# EAGLE design schematic (EAGLE 6.2)
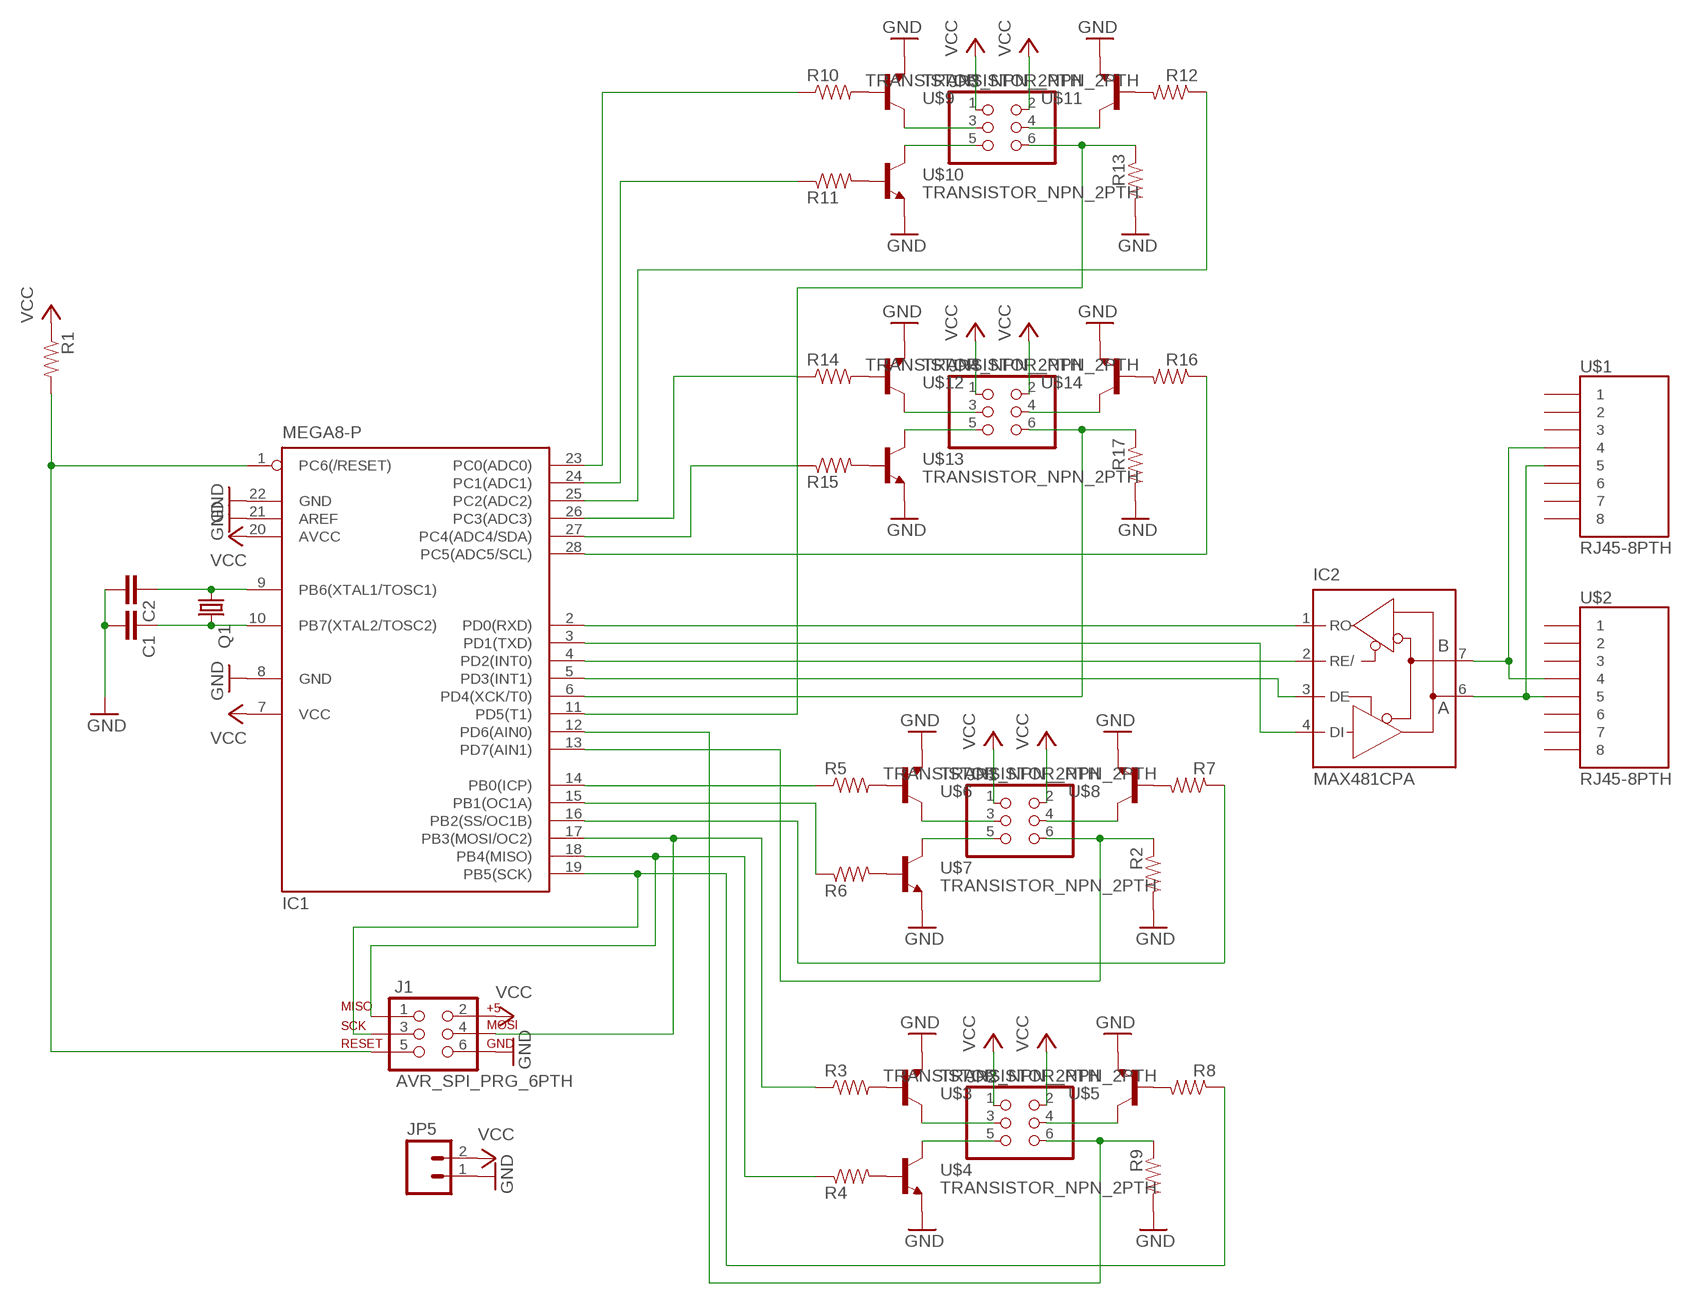
[diagram p0: schematic, sheet 1]

## Parts
C1  CAPKIT  [CAP-PTH-SMALL-KIT]
C2  CAPKIT  [CAP-PTH-SMALL-KIT]
IC1  MEGA8-P  [DIL28-3]
IC2  MAX481CPA  [DIL08]
J1  AVR_SPI_PRG_6PTH  [2X3]
JP1  PINHD-2X3  [2X03]
JP2  PINHD-2X3  [2X03]
JP3  PINHD-2X3  [2X03]
JP4  PINHD-2X3  [2X03]
JP5  M023.5MM  [SCREWTERMINAL-3.5MM-2]
Q1  CRYSTALHC49U-V  [HC49U-V]
R1  RESISTORPTH-1/4W  [AXIAL-0.4]
R2  RESISTORPTH-1/4W  [AXIAL-0.4]
R3  RESISTORPTH-1/4W  [AXIAL-0.4]
R4  RESISTORPTH-1/4W  [AXIAL-0.4]
R5  RESISTORPTH-1/4W  [AXIAL-0.4]
R6  RESISTORPTH-1/4W  [AXIAL-0.4]
R7  RESISTORPTH-1/4W  [AXIAL-0.4]
R8  RESISTORPTH-1/4W  [AXIAL-0.4]
R9  RESISTORPTH-1/4W  [AXIAL-0.4]
R10  RESISTORPTH-1/4W  [AXIAL-0.4]
R11  RESISTORPTH-1/4W  [AXIAL-0.4]
R12  RESISTORPTH-1/4W  [AXIAL-0.4]
R13  RESISTORPTH-1/4W  [AXIAL-0.4]
R14  RESISTORPTH-1/4W  [AXIAL-0.4]
R15  RESISTORPTH-1/4W  [AXIAL-0.4]
R16  RESISTORPTH-1/4W  [AXIAL-0.4]
R17  RESISTORPTH-1/4W  [AXIAL-0.4]
U$1  RJ45-8PTH  [RJ45-8]
U$2  RJ45-8PTH  [RJ45-8]
U$3  TRANSISTOR_NPN_2PTH  [TO-92]
U$4  TRANSISTOR_NPN_2PTH  [TO-92]
U$5  TRANSISTOR_NPN_2PTH  [TO-92]
U$6  TRANSISTOR_NPN_2PTH  [TO-92]
U$7  TRANSISTOR_NPN_2PTH  [TO-92]
U$8  TRANSISTOR_NPN_2PTH  [TO-92]
U$9  TRANSISTOR_NPN_2PTH  [TO-92]
U$10  TRANSISTOR_NPN_2PTH  [TO-92]
U$11  TRANSISTOR_NPN_2PTH  [TO-92]
U$12  TRANSISTOR_NPN_2PTH  [TO-92]
U$13  TRANSISTOR_NPN_2PTH  [TO-92]
U$14  TRANSISTOR_NPN_2PTH  [TO-92]

## Nets
GND: C1.2 C2.2 IC1.8(GND) IC1.21(AREF) IC1.22(GND) J1.6 JP5.1 R2.P$2 R9.P$2 R13.P$2 R17.P$2 U$3.3(E) U$4.3(E) U$5.3(E) U$6.3(E) U$7.3(E) U$8.3(E) U$9.3(E) U$10.3(E) U$11.3(E) U$12.3(E) U$13.3(E) U$14.3(E)
N$1: IC2.7(B) U$1.4 U$2.4
N$2: IC2.6(A) U$1.5 U$2.5
N$3: IC1.26(PC3(ADC3)) R14.P$1
N$4: C2.1 IC1.9(PB6(XTAL1/TOSC1)) Q1.1
N$5: C1.1 IC1.10(PB7(XTAL2/TOSC2)) Q1.2
N$6: JP1.3 U$6.1(C)
N$7: IC1.2(PD0(RXD)) IC2.1(RO)
N$8: IC1.3(PD1(TXD)) IC2.4(DI)
N$9: JP1.5 U$7.1(C)
N$10: JP1.4 U$8.1(C)
N$11: IC1.27(PC4(ADC4/SDA)) R15.P$1
N$12: IC1.14(PB0(ICP)) R5.P$1
N$13: IC1.15(PB1(OC1A)) R6.P$1
N$14: IC1.13(PD7(AIN1)) JP1.6 R2.P$1
N$16: IC1.5(PD3(INT1)) IC2.3(DE)
N$17: R5.P$2 U$6.2(B)
N$18: IC1.1(PC6(/RESET)) J1.5 R1.P$2
N$19: R6.P$2 U$7.2(B)
N$20: R7.P$2 U$8.2(B)
N$21: IC1.12(PD6(AIN0)) JP2.6 R9.P$1
N$22: IC1.4(PD2(INT0)) IC2.2(RE/)
N$23: R3.P$2 U$3.2(B)
N$24: R4.P$2 U$4.2(B)
N$25: R8.P$2 U$5.2(B)
N$26: IC1.19(PB5(SCK)) J1.3 R8.P$1
N$27: IC1.16(PB2(SS/OC1B)) R7.P$1
N$28: JP2.3 U$3.1(C)
N$29: JP2.5 U$4.1(C)
N$30: JP2.4 U$5.1(C)
N$31: IC1.11(PD5(T1)) JP3.6 R13.P$1
N$32: R10.P$2 U$9.2(B)
N$33: R11.P$2 U$10.2(B)
N$34: R12.P$2 U$11.2(B)
N$35: IC1.24(PC1(ADC1)) R11.P$1
N$36: IC1.25(PC2(ADC2)) R12.P$1
N$39: JP3.3 U$9.1(C)
N$40: JP3.5 U$10.1(C)
N$41: JP3.4 U$11.1(C)
N$42: IC1.6(PD4(XCK/T0)) JP4.6 R17.P$1
N$43: R14.P$2 U$12.2(B)
N$45: R15.P$2 U$13.2(B)
N$47: R16.P$2 U$14.2(B)
N$48: IC1.23(PC0(ADC0)) R10.P$1
N$50: IC1.28(PC5(ADC5/SCL)) R16.P$1
N$51: JP4.3 U$12.1(C)
N$52: JP4.5 U$13.1(C)
N$53: JP4.4 U$14.1(C)
N$54: IC1.17(PB3(MOSI/OC2)) J1.4 R3.P$1
N$55: IC1.18(PB4(MISO)) J1.1 R4.P$1
VCC: IC1.7(VCC) IC1.20(AVCC) J1.2 JP1.1 JP1.2 JP2.1 JP2.2 JP3.1 JP3.2 JP4.1 JP4.2 JP5.2 R1.P$1
Unconnected: U$1.1 U$1.2 U$1.3 U$1.6 U$1.7 U$1.8 U$2.1 U$2.2 U$2.3 U$2.6 U$2.7 U$2.8

## Power pins joined to a net without a drawn wire
GND: IC2.5(GND)
VCC: IC2.8(VCC)

## Library data of the parts
C1 C2 = SparkFun-Passives:CAP: Capacitor Standard 0603 ceramic capacitor, and 0.1" leaded capacitor.
IC1 = atmel:MEGA8-P: MICROCONTROLLER 8 Kbytes FLASH, 1 kbytes SRAM, 512 bytes EEPROM, USART, 4-channel 10 bit ADC, 2-channel 8 bit ADC Pin compatible with Atmega48, ATMega88, ATMega168 Source: avr.lbr; OC_FARNELL: unknown; OC_NEWARK: unknown
IC2 = maxim:MAX481CPA: RS485 TRANSEIVER; MPN: MAX481CPA+; OC_FARNELL: unknown; OC_NEWARK: 99K3445
J1 = SparkFun-Connectors:AVR_SPI_PRG_6: AVR ISP 6 Pin This is the reduced ISP connector for AVR programming. Common on Arduino. This footprint will take up less PCB space and can be used with a 10-pin to 6-pin adapter such as SKU: BOB-08508
JP1-JP4 = SparkFun-Connectors:PINHD-2X3: PIN HEADER
JP5 = SparkFun-Connectors:M02: Header 2 Standard 2-pin 0.1" header. Use with straight break away headers (SKU : PRT-00116), right angle break away headers (PRT-00553), swiss pins (PRT-00743), machine pins (PRT-00117), and female headers (PRT-00115). Molex polarized connector foot print use with SKU : PRT-08233 with associated crimp pins and housings.
Q1 = crystal:CRYSTAL: CRYSTAL; OC_FARNELL: 1666969; OC_NEWARK: unknown
R1-R17 = SparkFun-Passives:RESISTOR: Resistor Basic schematic elements and footprints for 0603, 1206, and PTH resistors.
U$1 U$2 = SparkFun-Connectors:RJ45-8: RJ45 Jack Simple RJ45, 8-pin connection - connector for common Cat5, Cat5e, and Cat6 Ethernet cables. Footprint not yet proven in production. Connector sku is PRT-00643; Breakout PCB sku is BOB-00716.
U$3-U$14 = SparkFun-DiscreteSemi:TRANSISTOR_NPN_2: Alternate TO-92 NPN BJT

## Board
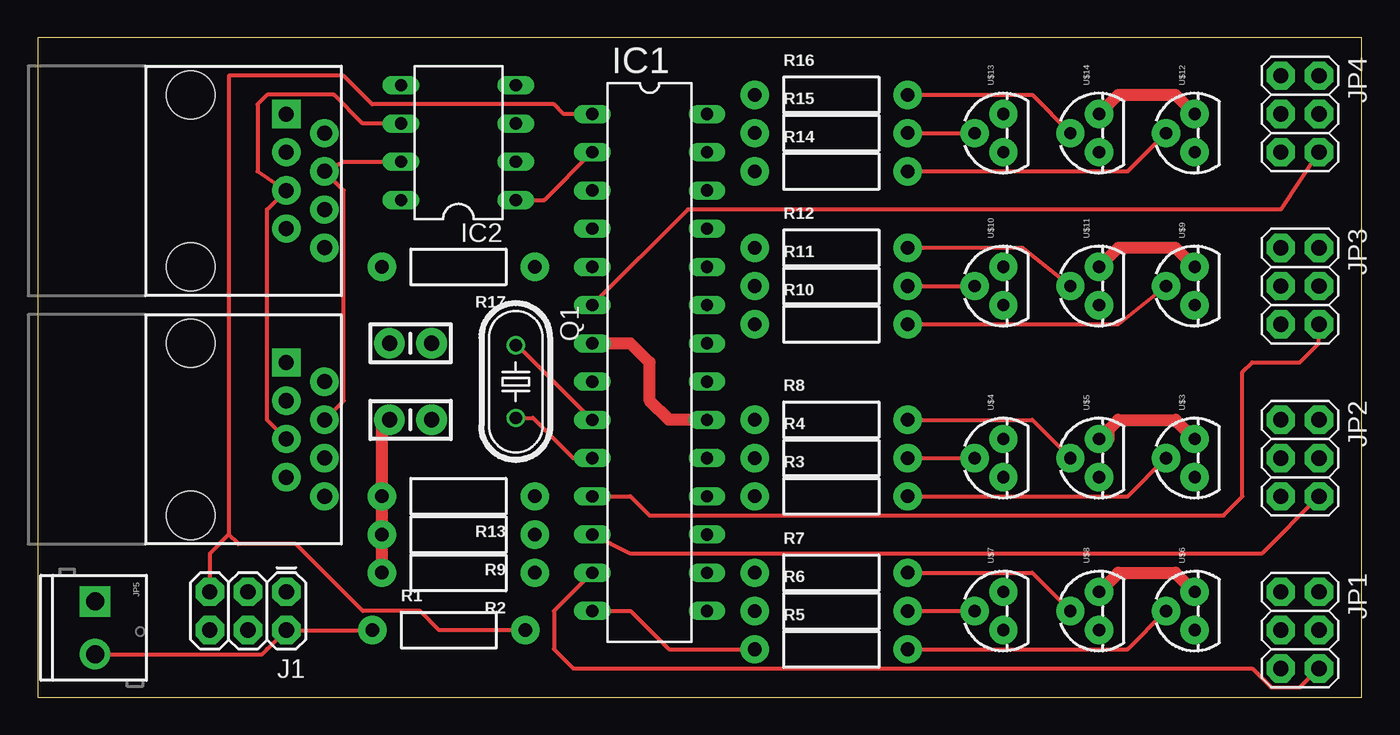
[diagram p1: board, top side]
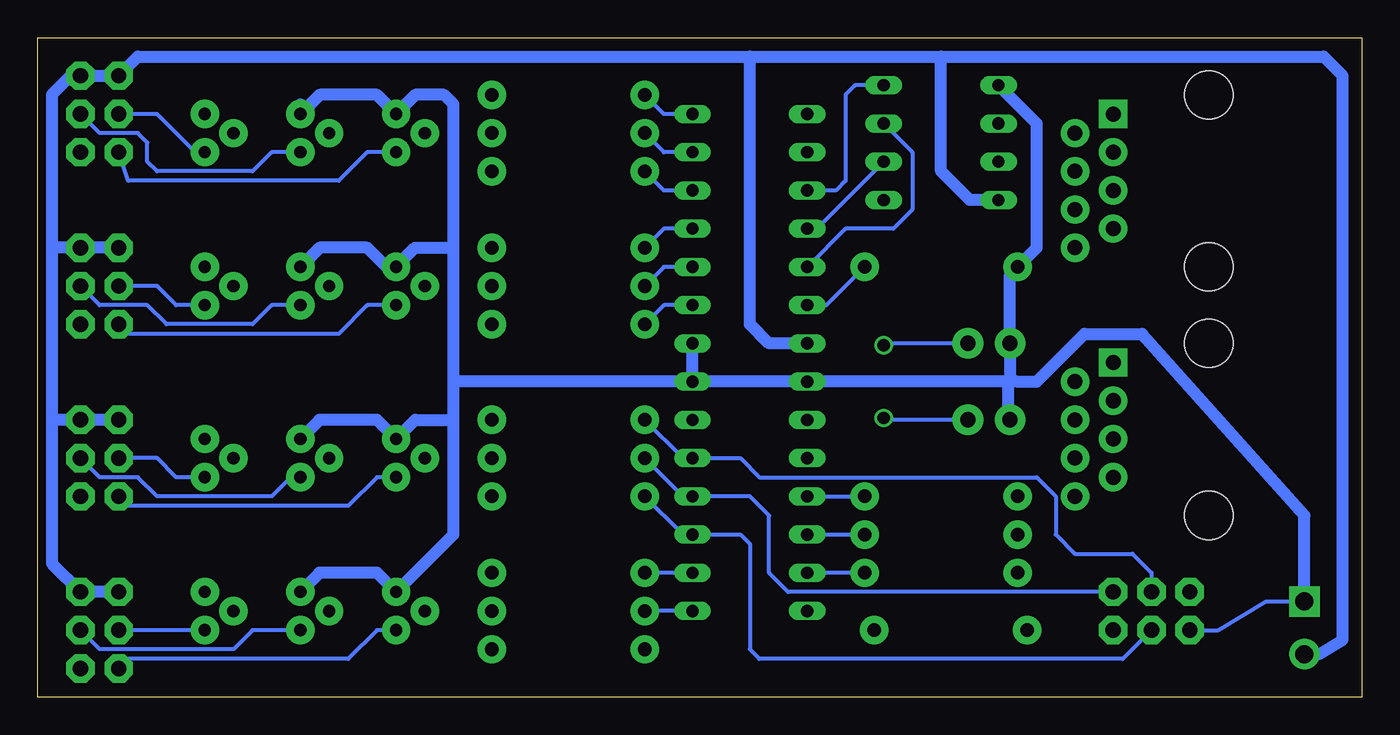
[diagram p2: board, bottom side, seen from below]

Size 87.94 x 43.8 mm. Coordinates in mm from the lower left corner, seen from the top.
Outline: 0,0 87.94,0 87.94,43.8 0,43.8 0,0
Copper layers (1*16): Top 0.0356mm / dielectric 1.5011mm / Bottom 0.0356mm
Design rules: minimum track width 6mil, minimum drill 13mil, track to track 6mil, track to pad 6mil, pad to pad 6mil, via to via 6mil, smd to smd 6mil, copper to edge 15mil, drill to drill 6mil, minimum pad ring 7mil, minimum via ring 7mil, stop-mask expansion 4mil, vias tented up to drill 0mil, thermal gap 10mil

### Footprints (pad centres in the part's own frame; a part is rotated, then mirrored left to right if it is on the bottom)
CAP-PTH-SMALL-KIT = drill 1.016 pad 2.032: 1 -1.397,0; 2 1.397,0
DIL28-3 = drill 0.813 long: 1 -16.51,-3.81; 2 -13.97,-3.81; 3 -11.43,-3.81; 4 -8.89,-3.81; 5 -6.35,-3.81; 6 -3.81,-3.81; 7 -1.27,-3.81; 8 1.27,-3.81; 9 3.81,-3.81; 10 6.35,-3.81; 11 8.89,-3.81; 12 11.43,-3.81; 13 13.97,-3.81; 14 16.51,-3.81; 15 16.51,3.81; 16 13.97,3.81; 17 11.43,3.81; 18 8.89,3.81; 19 6.35,3.81; 20 3.81,3.81; 21 1.27,3.81; 22 -1.27,3.81; 23 -3.81,3.81; 24 -6.35,3.81; 25 -8.89,3.81; 26 -11.43,3.81; 27 -13.97,3.81; 28 -16.51,3.81
DIL08 = drill 0.813 long: 1 -3.81,-3.81; 2 -1.27,-3.81; 3 1.27,-3.81; 4 3.81,-3.81; 5 3.81,3.81; 6 1.27,3.81; 7 -1.27,3.81; 8 -3.81,3.81
2X3 = drill 1.016 pad 1.88 octagon: 1 0,0; 2 0,2.54; 3 2.54,0; 4 2.54,2.54; 5 5.08,0; 6 5.08,2.54
2X03 = drill 1.016 pad 1.88 octagon: 1 -2.54,-1.27; 2 -2.54,1.27; 3 0,-1.27; 4 0,1.27; 5 2.54,-1.27; 6 2.54,1.27
SCREWTERMINAL-3.5MM-2 = drill 1.2 pad 2.032 square: 1 0,0 | drill 1.2 pad 2.032: 2 3.5,0
HC49U-V = drill 0.813: 1 -2.413,0; 2 2.413,0
AXIAL-0.4 = drill 0.9 pad 1.88: P$1 -5.08,0; P$2 5.08,0
RJ45-8 = drill 1 pad 1.88 square: 1 -4.445,6.35 | drill 1 pad 1.88: 2 -3.175,8.89; 3 -1.905,6.35; 4 -0.635,8.89; 5 0.635,6.35; 6 1.905,8.89; 7 3.175,6.35; 8 4.445,8.89 | hole 3.2: -5.715,0; 5.715,0
TO-92 = drill 0.813 pad 1.88: 1 -1.27,0; 2 0,1.905; 3 1.27,0

### Placement (x,y rotation side)
C1  24.77,18.41 180 top
C2  24.77,23.49 180 top
IC1  40.64,22.23 270 top
IC2  27.94,36.83 90 top
J1  16.51,6.98 180 top
JP1  83.82,4.45 270 top
JP2  83.82,15.88 270 top
JP3  83.82,27.3 270 top
JP4  83.82,38.73 270 top
JP5  3.81,6.35 270 top
Q1  31.75,20.95 270 top
R1  27.3,4.45 0 top
R2  27.94,8.26 180 top
R3  52.7,13.34 0 top
R4  52.7,15.88 0 top
R5  52.7,3.18 0 top
R6  52.7,5.71 0 top
R7  52.7,8.26 0 top
R8  52.7,18.41 0 top
R9  27.94,10.8 180 top
R10  52.7,24.77 0 top
R11  52.7,27.3 0 top
R12  52.7,29.84 0 top
R13  27.94,13.34 180 top
R14  52.7,34.92 0 top
R15  52.7,37.46 0 top
R16  52.7,40 0 top
R17  27.94,28.58 180 top
U$1  10.16,34.29 270 top
U$2  10.16,17.78 270 top
U$3  76.83,15.88 90 top
U$4  64.13,15.88 90 top
U$5  70.48,15.88 90 top
U$6  76.83,5.71 90 top
U$7  64.13,5.71 90 top
U$8  70.48,5.71 90 top
U$9  76.83,27.3 90 top
U$10  64.13,27.3 90 top
U$11  70.48,27.3 90 top
U$12  76.83,37.46 90 top
U$13  64.13,37.46 90 top
U$14  70.48,37.46 90 top

### Tracks (layer width: path | path; a pad name or v marks a point on that pad's centre or on a via)
GND
  Top 0.813: U$11.3 71.75,29.84 75.56,29.84 U$9.3 | U$14.3 71.75,40 75.56,40 U$12.3 | U$5.3 71.12,17.14 71.12,17.78 71.75,18.41 75.56,18.41 U$3.3 | U$8.3 71.75,8.26 75.56,8.26 U$6.3 | R2.P$2 R9.P$2 R13.P$2 22.86,17.91 C1.2
  Bottom 0.254: 23.37,21.46 22.86,20.95 | 23.5,18.54 C1.2 | 23.37,28.07 R17.P$2 | J1.6 9.53,4.45 6.35,6.35 JP5.1
  Bottom 0.813: IC1.21 IC1.8 23.5,20.95 | U$11.3 69.22,29.84 66.04,29.84 64.77,28.58 U$10.3 62.86,29.84 60.33,29.84 | 70.48,39.37 U$14.3 69.22,40 65.41,40 U$13.3 62.86,40 60.96,40 60.33,39.37 60.33,29.84 | U$5.3 69.22,18.41 65.41,18.41 U$4.3 62.86,18.41 60.33,18.41 | IC1.21 60.33,20.95 | 60.33,20.95 60.33,29.84 | 60.33,18.41 60.33,10.8 U$7.3 65.41,8.26 69.22,8.26 U$8.3 | 60.33,18.41 60.33,20.95 | 23.5,20.95 22.86,20.95 21.59,20.95 18.42,24.13 14.6,24.13 3.81,12.06 JP5.1 | IC1.21 IC1.22 | 23.37,21.46 C2.2 23.37,28.07 | 23.5,20.95 23.5,18.54 | R17.P$2 21.59,29.84 21.59,38.1 IC2.5
N$1
  Top 0.254: U$2.4 20.32,19.69 20.32,33.66 U$1.4 20.32,35.56 IC2.7
N$2
  Top 0.254: U$2.5 15.24,18.41 15.24,32.38 U$1.5 14.6,34.92 14.6,39.37 15.24,40 19.69,40 21.59,38.1 IC2.6
N$3
  Bottom 0.254: IC1.26 46.35,33.66 R14.P$1
N$4
  Top 0.254: Q1.1 31.88,23.37 IC1.9
  Bottom 0.254: C2.1 31.62,23.49 Q1.1
N$5
  Top 0.254: Q1.2 32.89,18.54 35.56,15.88 IC1.10
  Bottom 0.254: C1.1 31.62,18.41 Q1.2
N$6
  Bottom 0.254: U$6.1 JP1.3
N$7
  Top 0.254: IC2.1 33.66,33.02 IC1.2
N$8
  Bottom 0.254: IC2.4 33.66,40.64 34.29,40 34.29,34.29 34.92,33.66 IC1.3
N$9
  Bottom 0.254: U$7.1 65.41,4.45 67.31,2.54 81.91,2.54 JP1.5
N$10
  Bottom 0.254: U$8.1 73.66,4.45 74.93,3.18 83.82,3.18 JP1.4
N$11
  Bottom 0.254: IC1.27 46.35,36.2 R15.P$1
N$12
  Top 0.254: IC1.14 39.37,5.71 41.91,3.18 R5.P$1
N$13
  Bottom 0.254: IC1.15 R6.P$1
N$14
  Top 0.254: IC1.13 34.29,5.71 34.29,3.18 35.56,1.91 80.64,1.91 81.91,0.63 83.82,0.63 JP1.6
  Bottom 0.254: R2.P$1 IC1.13
N$16
  Bottom 0.254: IC2.3 29.85,36.2 29.85,32.38 31.11,31.12 34.29,31.12 IC1.5
N$17
  Top 0.254: R5.P$2 72.39,3.18 U$6.2
N$18
  Top 0.254: IC1.1 34.92,38.73 34.29,39.37 22.23,39.37 20.32,41.28 12.7,41.28 12.7,10.8 | 12.7,10.8 11.43,9.52 J1.5 | R1.P$2 26.67,4.45 25.4,5.71 21.59,5.71 17.14,10.16 13.33,10.16 12.7,10.8
N$19
  Top 0.254: R6.P$2 U$7.2
N$20
  Top 0.254: R7.P$2 66.04,8.26 U$8.2
N$21
  Top 0.254: JP2.6 81.28,9.52 39.37,9.52 IC1.12
  Bottom 0.254: IC1.12 R9.P$1
N$22
  Bottom 0.254: IC2.2 36.2,31.12 IC1.4
N$23
  Top 0.254: R3.P$2 72.39,13.34 U$3.2
N$24
  Top 0.254: R4.P$2 U$4.2
N$25
  Top 0.254: R8.P$2 66.04,18.41 U$5.2
N$26
  Bottom 0.254: R8.P$1 45.09,15.88 IC1.19 41.27,15.88 40,14.6 21.59,14.6 20.32,13.34 20.32,10.8 19.05,9.52 15.24,9.52 13.97,8.26 J1.3
N$27
  Bottom 0.254: IC1.16 R7.P$1
N$28
  Bottom 0.254: U$3.1 78.74,14.6 80.01,15.88 JP2.3
N$29
  Bottom 0.254: U$4.1 65.41,14.6 67.31,12.7 81.91,12.7 JP2.5
N$30
  Bottom 0.254: U$5.1 71.12,14.6 72.39,13.34 80.01,13.34 81.28,14.6 83.82,14.6 JP2.4
N$31
  Top 0.254: IC1.11 39.37,13.34 40.64,12.06 78.74,12.06 80.01,13.34 80.01,21.59 80.64,22.23 83.82,22.23 85.09,23.49 JP3.6
  Bottom 0.254: IC1.11 R13.P$1
N$32
  Top 0.254: R10.P$2 71.75,24.77 U$9.2
N$33
  Top 0.254: R11.P$2 U$10.2
N$34
  Top 0.254: R12.P$2 65.41,29.84 U$11.2
N$35
  Bottom 0.254: IC1.24 46.35,28.58 R11.P$1
N$36
  Bottom 0.254: IC1.25 46.35,31.12 R12.P$1
N$39
  Bottom 0.254: U$9.1 78.74,26.03 80.01,27.3 JP3.3
N$40
  Bottom 0.254: U$10.1 66.04,26.03 67.94,24.13 81.91,24.13 JP3.5
N$41
  Bottom 0.254: U$11.1 72.39,26.03 73.66,24.77 79.38,24.77 80.64,26.03 83.82,26.03 JP3.4
N$42
  Top 0.254: JP4.6 82.55,32.38 43.18,32.38 IC1.6
  Bottom 0.254: IC1.6 35.56,26.03 R17.P$1
N$43
  Top 0.254: R14.P$2 72.39,34.92 U$12.2
N$45
  Top 0.254: R15.P$2 U$13.2
N$47
  Top 0.254: R16.P$2 66.04,40 U$14.2
N$48
  Bottom 0.254: IC1.23 46.35,26.03 R10.P$1
N$50
  Bottom 0.254: IC1.28 46.35,38.73 R16.P$1
N$51
  Bottom 0.254: U$12.1 77.47,36.2 80.01,38.73 JP4.3
N$52
  Bottom 0.254: U$13.1 66.04,36.2 67.94,34.29 81.91,34.29 JP4.5
N$53
  Bottom 0.254: U$14.1 72.39,36.2 73.66,34.92 80.01,34.92 80.64,35.56 80.64,36.83 81.28,37.46 83.82,37.46 JP4.4
N$54
  Bottom 0.254: R3.P$1 45.09,10.8 IC1.17 41.27,10.8 40.64,10.16 40.64,3.18 40,2.54 15.87,2.54 J1.4
N$55
  Bottom 0.254: R4.P$1 45.09,13.34 IC1.18 40.64,13.34 39.37,12.06 39.37,8.26 38.1,6.98 J1.1
VCC
  Top 0.254: J1.2 R1.P$1 | J1.2 15.24,3.18 | JP5.2 14.92,2.85 J1.2
  Top 0.813: IC1.20 41.91,18.41 40.64,19.69 40.64,22.23 39.37,23.49 IC1.7
  Bottom 0.813: JP1.1 JP1.2 87,8.89 87,18.41 | JP2.1 JP2.2 87,18.41 | JP3.1 JP3.2 87,29.84 | 40.64,42.55 81.28,42.55 JP4.1 JP4.2 85.72,41.28 87,40 87,29.84 | 40.64,42.55 27.94,42.55 | 27.94,42.55 2.54,42.55 1.27,41.28 1.27,3.81 2.85,2.85 JP5.2 | 87,29.84 87,18.41 | IC1.7 39.37,23.49 40.64,24.77 40.64,42.55 | IC2.8 26.04,33.02 27.94,34.92 27.94,42.55